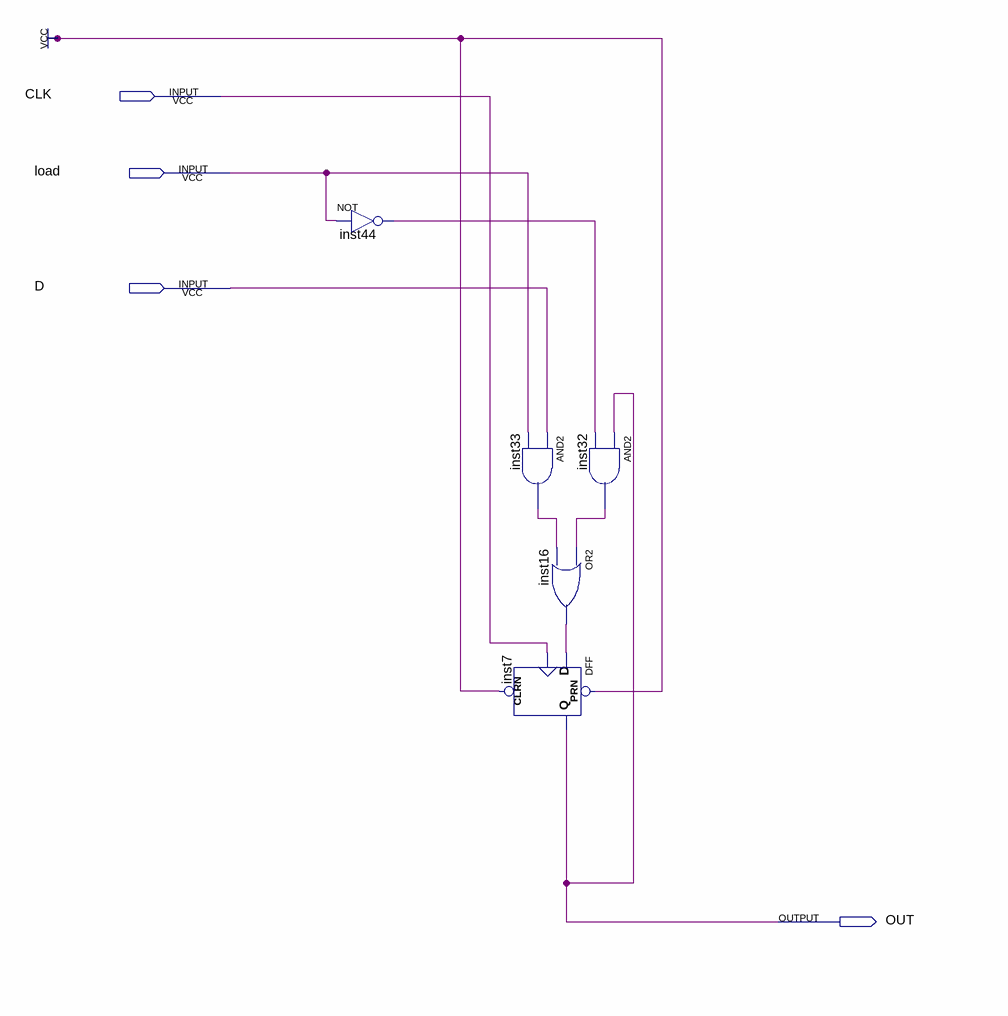
[diagram p0: schematic sheet]
// Quartus schematic reg1bit.bdf as structural Verilog: 5 symbols, 4 pins
module reg1bit (
  input  CLK,
  input  load,
  input  D,
  output OUT
);

  wire inst16_out, inst32_out, inst33_out, inst44_out;

  not inst44 (inst44_out, load);
  and inst33 (inst33_out, D, load);
  or inst16 (inst16_out, inst32_out, inst33_out);
  DFF inst7 (.CLRN(1'b1), .CLK(CLK), .D(inst16_out), .PRN(1'b1), .Q(OUT));
  and inst32 (inst32_out, OUT, inst44_out);
endmodule
